# Altium schematic sheet Power Supply.SchDoc: Power Supply (part 1 of 2)
size A2; ApprovedBy: JTS; CheckedBy: JTS; DrawnBy: EBC; DocumentNumber: -; Revision: 09; SheetNumber: 2; SheetTotal: 7; SenaiProjectName: EzPower v4
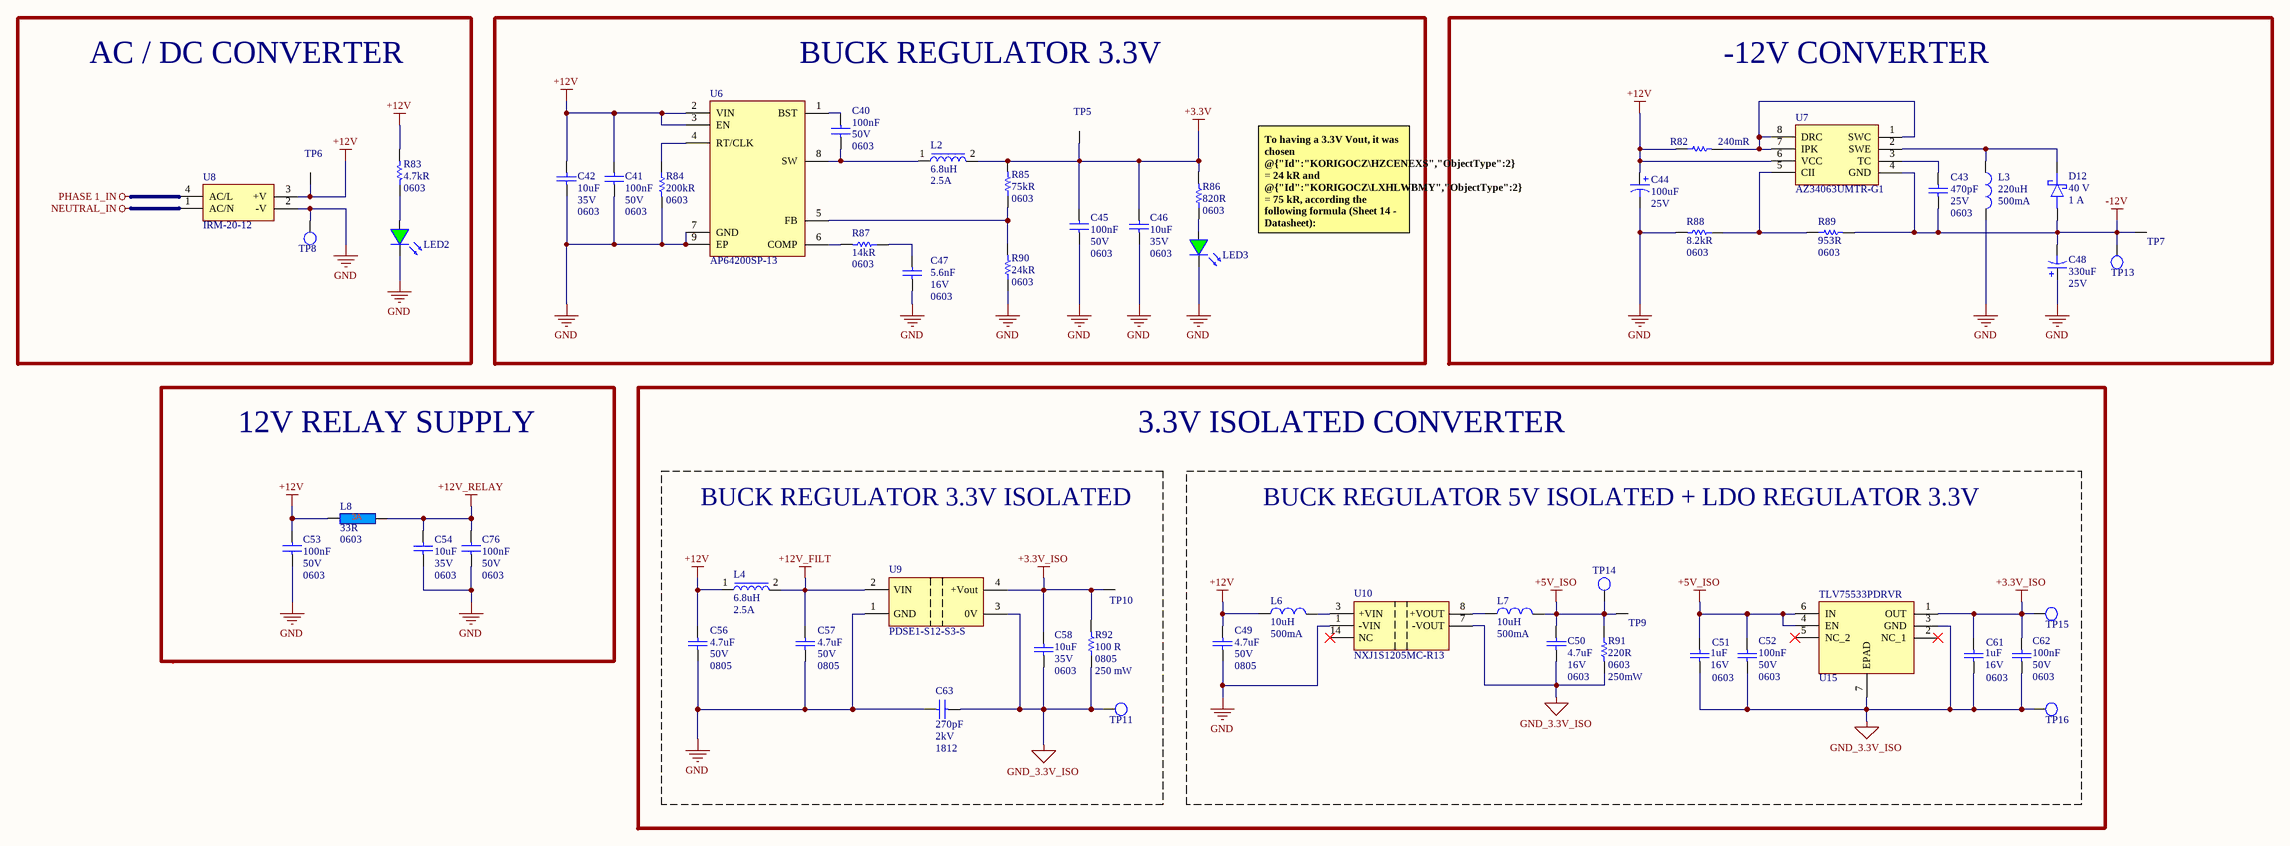
[diagram p0: Power Supply.SchDoc]

## Parts
C40  value 100nF  Case/Package: 0603  Voltage Rating: 50V  [C0603]  (hidden comment: CC0603MRX7R9BB104)
C41  value 100nF  Case/Package: 0603  Voltage Rating: 50V  [C0603]  (hidden comment: CC0603MRX7R9BB104)
C42  Case/Package: 0603  Capacitance: 10uF  Voltage Rating: 35V  [C0603]  (hidden comment: C_0603_10uF_35V_20%)
C43  value 470pF  Case/Package: 0603  Voltage Rating: 25V  [C0603]  (hidden comment: CC0603KRX7R8BB471)
C44  value 100uF  Voltage Rating (DC): 25V  [CAP 6.6MMX6.6MM]  (hidden comment: 865080445010)
C45  value 100nF  Case/Package: 0603  Voltage Rating: 50V  [C0603]  (hidden comment: CC0603MRX7R9BB104)
C46  Case/Package: 0603  Capacitance: 10uF  Voltage Rating: 35V  [C0603]  (hidden comment: C_0603_10uF_35V_20%)
C47  value 5.6nF  Case Code (Imperial): 0603  Voltage Rating: 16V  [C0603]  (hidden comment: C0603C562K4RACTU)
C48  value 330uF  Voltage Rating: 25V  [CAP8MMX10MM]  (hidden comment: UWT1E331MNL1GS)
C49  value 4.7uF  Case/Package: 0805  Voltage Rating: 50V  [C0805]  (hidden comment: GRM21BR61H475ME51L)
C50  value 4.7uF  Case Code (Imperial): 0603  Voltage Rating: 16V  [C0603]  (hidden comment: CL10A475KO8NNNC)
C51  Voltage Rating: 16V  Capacitance: 1uF  Package: 0603  [C0603]  (hidden comment: CL10A105KO8NNWC)
C52  value 100nF  Case/Package: 0603  Voltage Rating: 50V  [C0603]  (hidden comment: CC0603MRX7R9BB104)
C53  value 100nF  Case/Package: 0603  Voltage Rating: 50V  [C0603]  (hidden comment: CC0603MRX7R9BB104)
C54  Case/Package: 0603  Capacitance: 10uF  Voltage Rating: 35V  [C0603]  (hidden comment: C_0603_10uF_35V_20%)
C56  value 4.7uF  Case/Package: 0805  Voltage Rating: 50V  [C0805]  (hidden comment: GRM21BR61H475ME51L)
C57  value 4.7uF  Case/Package: 0805  Voltage Rating: 50V  [C0805]  (hidden comment: GRM21BR61H475ME51L)
C58  Case/Package: 0603  Capacitance: 10uF  Voltage Rating: 35V  [C0603]  (hidden comment: C_0603_10uF_35V_20%)
C61  Voltage Rating: 16V  Capacitance: 1uF  Package: 0603  [C0603]  (hidden comment: CL10A105KO8NNWC)
C62  value 100nF  Case/Package: 0603  Voltage Rating: 50V  [C0603]  (hidden comment: CC0603MRX7R9BB104)
C63  Voltage: 2kV  Package: 1812  Capacitance: 270pF  [C1812]  (hidden comment: 1812N271G202CT)
C76  value 100nF  Case/Package: 0603  Voltage Rating: 50V  [C0603]  (hidden comment: CC0603MRX7R9BB104)
D12  Voltage: 40 V  Current: 1 A  [SOD123]  (hidden comment: 1N5819HWQ-7-F)
L2  Max DC Current: 2.5A  Inductance: 6.8uH  [L6MMX6MM]  (hidden comment: LSXND6060WHL6R8MMG)
L3  value 220uH  Current Rating: 500mA  [L4.8MMX2.8MM]  (hidden comment: SRR4828A-221M)
L4  Max DC Current: 2.5A  Inductance: 6.8uH  [L6MMX6MM]  (hidden comment: LSXND6060WHL6R8MMG)
L6  Max Current Rating: 500mA  Inductance-Nom (L): 10uH  [L_3.2 mm x 2.5 mm]  (hidden comment: 82103C)
L7  Max Current Rating: 500mA  Inductance-Nom (L): 10uH  [L_3.2 mm x 2.5 mm]  (hidden comment: 82103C)
L8  Impedance: 33R  Case/Package: 0603  [L0603]  (hidden comment: BLM18PG330SZ1D)
LED2  LED 0603 SMD GREEN  [LED0603-GREEN]  (value not drawn)
LED3  LED 0603 SMD GREEN  [LED0603-GREEN]  (value not drawn)
R82  value 240mR  [R0805]  (hidden comment: ERJ-6DQJR24V)
R83  Case Code (Imperial): 0603  Resistance: 4.7kR  [R0603]  (hidden comment: R_0603_4.7k_1%_1/10W)
R84  value 200kR  Case/Package: 0603  [R0603]  (hidden comment: RT0603FRD07200KL)
R85  value 75kR  Case/Package: 0603  [R0603]  (hidden comment: ERJ-3EKF7502V)
R86  value 820R  Case Code (Imperial): 0603  [R0603]  (hidden comment: RK73B1JTTD821J)
R87  Case/Package: 0603  Resistance: 14kR  [R0603]  (hidden comment: R_0603_14kR_1%_1/10W)
R88  value 8.2kR  Case/Package: 0603  [R0603]  (hidden comment: RMC1/16K8201FTP)
R89  value 953R  Case/Package: 0603  [R0603]  (hidden comment: RC0603FR-07953RL)
R90  value 24kR  Case/Package: 0603  [R0603]  (hidden comment: RT0603FRE0724KL)
R91  value 220R  Power: 250mW  Case/Package: 0603  [R0603]  (hidden comment: RCS0603220RFKEA)
R92  Power Rating: 250 mW  Package: 0805  Resistance: 100 R  [R0805]  (hidden comment: AC0805FR-7W100RL)
TP5  S2761-46R  [TP_S276146R]  (value not drawn)
TP6  S2761-46R  [TP_S276146R]  (value not drawn)
TP7  S2761-46R  [TP_S276146R]  (value not drawn)
TP8  TP_PTH  [CON_TP_TH_V_BLACK_KEC_5001]  (value not drawn)
TP9  S2761-46R  [TP_S276146R]  (value not drawn)
TP10  S2761-46R  [TP_S276146R]  (value not drawn)
TP11  TP_PTH  [CON_TP_TH_V_BLACK_KEC_5001]  (value not drawn)
TP13  TP_SMT_CIRCLE  [Test Point 1.5 mm]  (value not drawn)
TP14  TP_SMT_CIRCLE  [Test Point 1.5 mm]  (value not drawn)
TP15  TP_SMT_CIRCLE  [Test Point 1.5 mm]  (value not drawn)
TP16  TP_SMT_CIRCLE  [Test Point 1.5 mm]  (value not drawn)
U6  Supplier Part Number 1: AP64200SP-13  [SO8EP]  (hidden comment: U_AP64200SP-13_SO-8EP)
U7  AZ34063UMTR-G1  [SOIC8]
U8  IRM-20-12  [MODULE IRM-20-12]
U9  PDSE1-S12-S3-S  [PDSE1S12S3S]
U10  NXJ1S1205MC-R13  [14-SMD Module]
U15  TLV75533PDRVR  [WSON-6]

## Blocks framed on the sheet
AC / DC CONVERTER: LED2 R83 TP6 TP8 U8
BUCK REGULATOR 3.3V: C40-C42 C45-C47 L2 LED3 R84-R87 R90 TP5 U6
-12V CONVERTER: C43 C44 C48 D12 L3 R82 R88 R89 TP7 TP13 U7
12V RELAY SUPPLY: C53 C54 C76 L8
BUCK REGULATOR 3.3V ISOLATED: C56-C58 C63 L4 R92 TP10 TP11 U9
BUCK REGULATOR 5V ISOLATED + LDO REGULATOR 3.3V: C49-C52 C61 C62 L6 L7 R91 TP9 TP14-TP16 U10 U15

## Nets
+3.3V: C45.2 C46.2 L2.2 R85.2 R86.2 TP5.1
+3.3V_ISO: C58.1 C61.2 C62.1 R92.2 TP10.1 TP15.1 U9.4(+Vout) U15.1(OUT)
+5V_ISO: C50.2 C51.2 C52.1 L7.2 R91.1 TP9.1 TP14.1 U15.4(EN) U15.6(IN)
+12V: C41.2 C42.1 C44.1 C49.2 C53.2 C56.2 L4.1 L6.1 L8.1 R82.1 R83.2 TP6.1 U6.2(VIN) U6.3(EN) U7.6(VCC) U8.3(+V)
+12V_FILT: C57.2 L4.2 U9.2(VIN)
+12V_RELAY: C54.1 C76.2 L8.2
-12V: C43.1 C48.2 D12.2(A) R89.2 TP7.1 TP13.1 U7.4(GND)
GND: C41.1 C42.2 C44.2 C45.1 C46.1 C47.1 C48.1 C49.1 C53.1 C54.2 C56.1 C57.1 C63.2 C76.1 L3.2 LED2.2(K) LED3.2(K) R84.2 R88.2 R90.1 TP8.1 U6.7(GND) U6.9(EP) U8.2(-V) U9.1(GND) U10.1(-VIN)
GND_3.3V_ISO: C50.1 C51.1 C52.2 C58.2 C61.1 C62.2 C63.1 R91.2 R92.1 TP11.1 TP16.1 U9.3(0V) U10.7(-VOUT) U15.3(GND) U15.7(EPAD)
NEUTRAL_IN: U8.1(AC/N)
PHASE 1_IN: U8.4(AC/L)
NetC40_1: C40.1 L2.1 U6.8(SW)
NetC40_2: C40.2 U6.1(BST)
NetC43_2: C43.2 U7.3(TC)
NetC47_2: C47.2 R87.1
NetD12_1: D12.1(K) L3.1 U7.2(SWE)
NetL6_2: L6.2 U10.3(+VIN)
NetL7_1: L7.1 U10.8(+VOUT)
NetLED2_1: LED2.1(A) R83.1
NetLED3_1: LED3.1(A) R86.1
NetR82_2: R82.2 U7.1(SWC) U7.7(IPK) U7.8(DRC)
NetR84_1: R84.1 U6.4(RT/CLK)
NetR85_1: R85.1 R90.2 U6.5(FB)
NetR87_2: R87.2 U6.6(COMP)
NetR88_1: R88.1 R89.1 U7.5(CII)

Not connected (* = marked no-connect by the designer): U10 14(NC)*; U15 2(NC_1)* 5(NC_2)*

## Notes on the sheet
- To having a 3.3V Vout, it was chosen @{"Id":"KORIGOCZ\HZCENEXS","ObjectType":2} = 24 kR and @{"Id":"KORIGOCZ\LXHLWBMY","ObjectType":2} = 75 kR, according the following formula (Sheet 14 - Datasheet):
  Ry = Rx * [ (Vout / 0,8) - 1 ]
- 3.3V ISOLATED CONVERTER
- Title:
- Size:
- Project:
- Revision:
- Date:
- Time:
- Variant:
- Drawn by:
- Checked by:
- A2
- Approved by:
- Sheet
- of